# Altium project ESP32 with USBC.PrjPcb
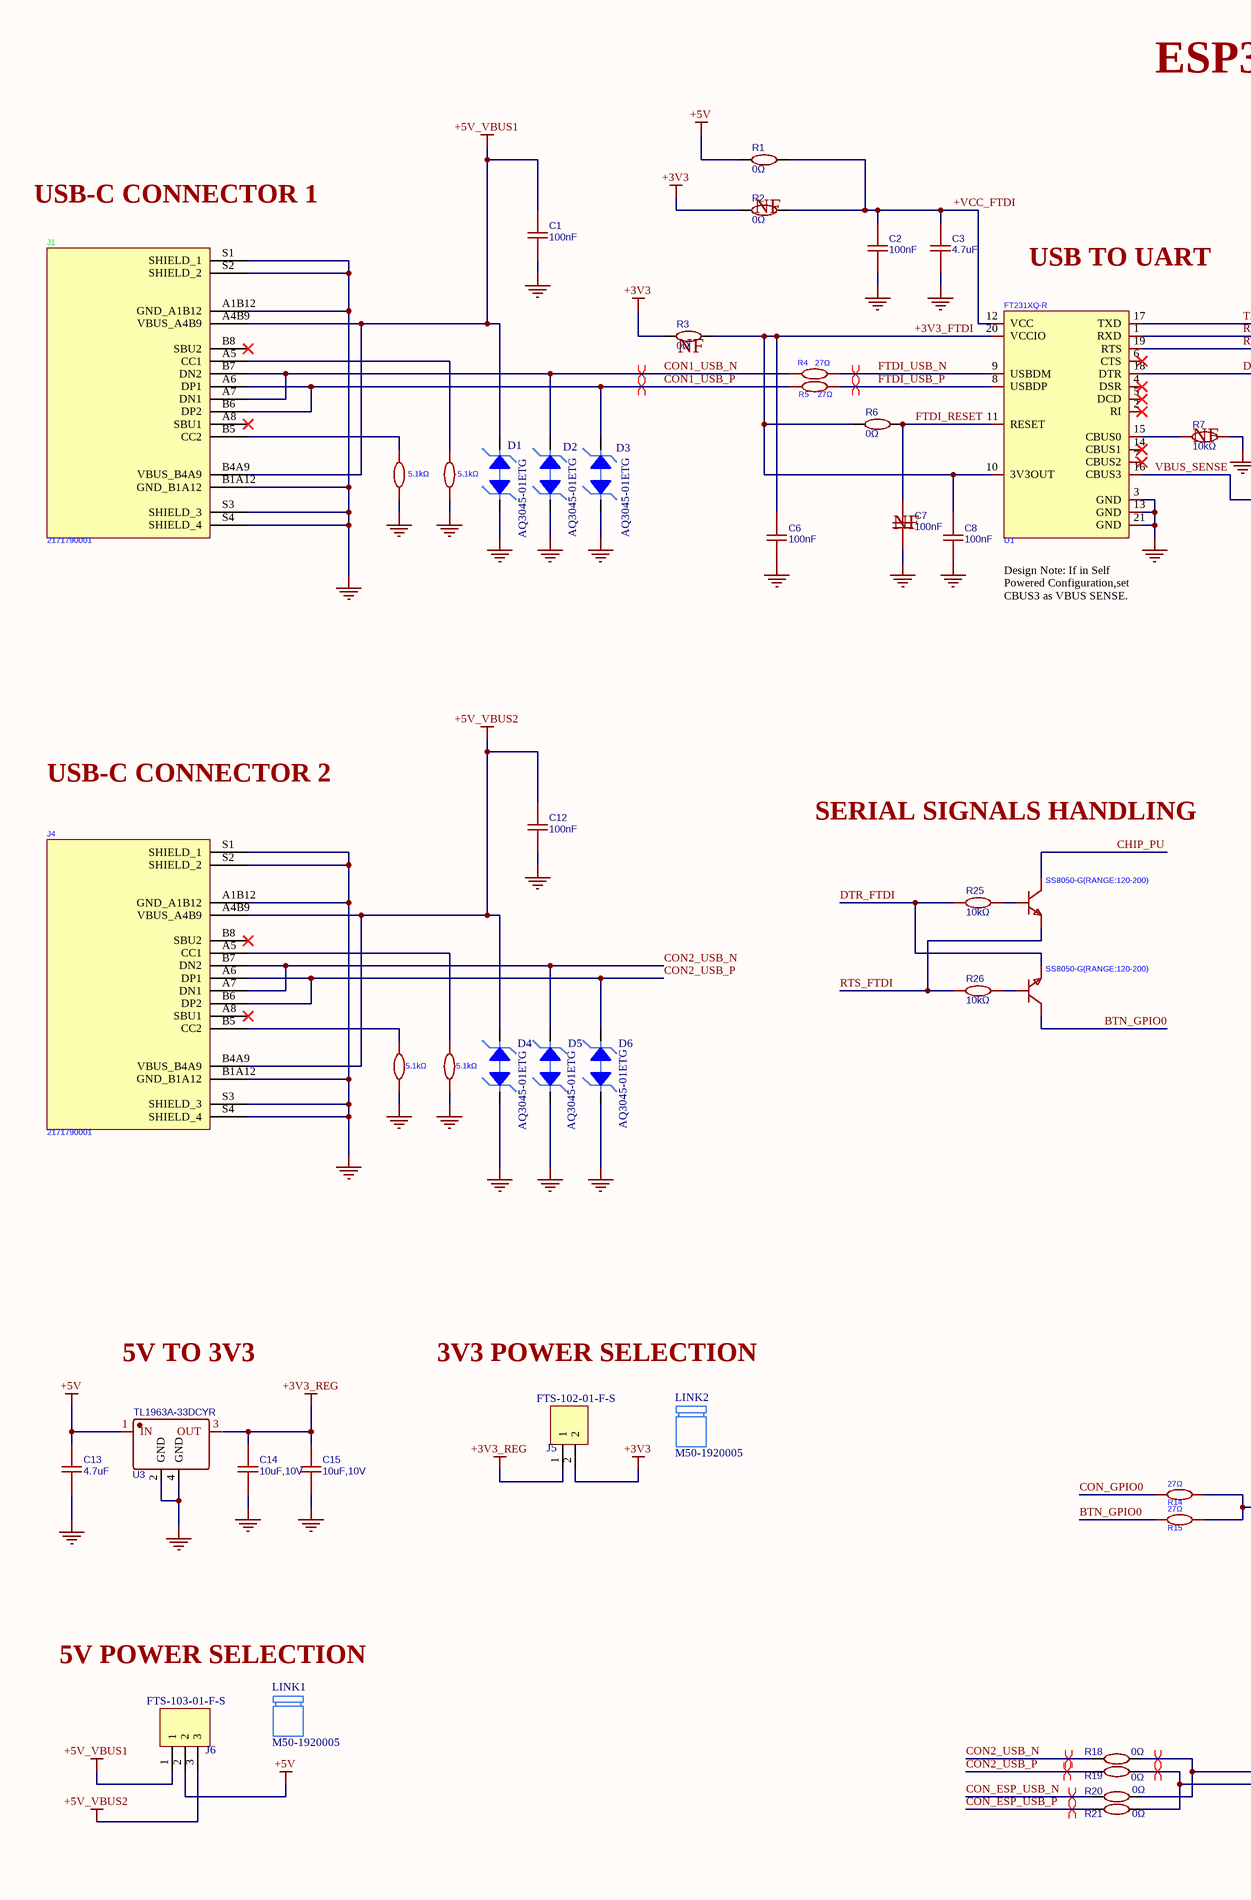
[diagram p0: ESP32 with USBC SCH.SchDoc, left]
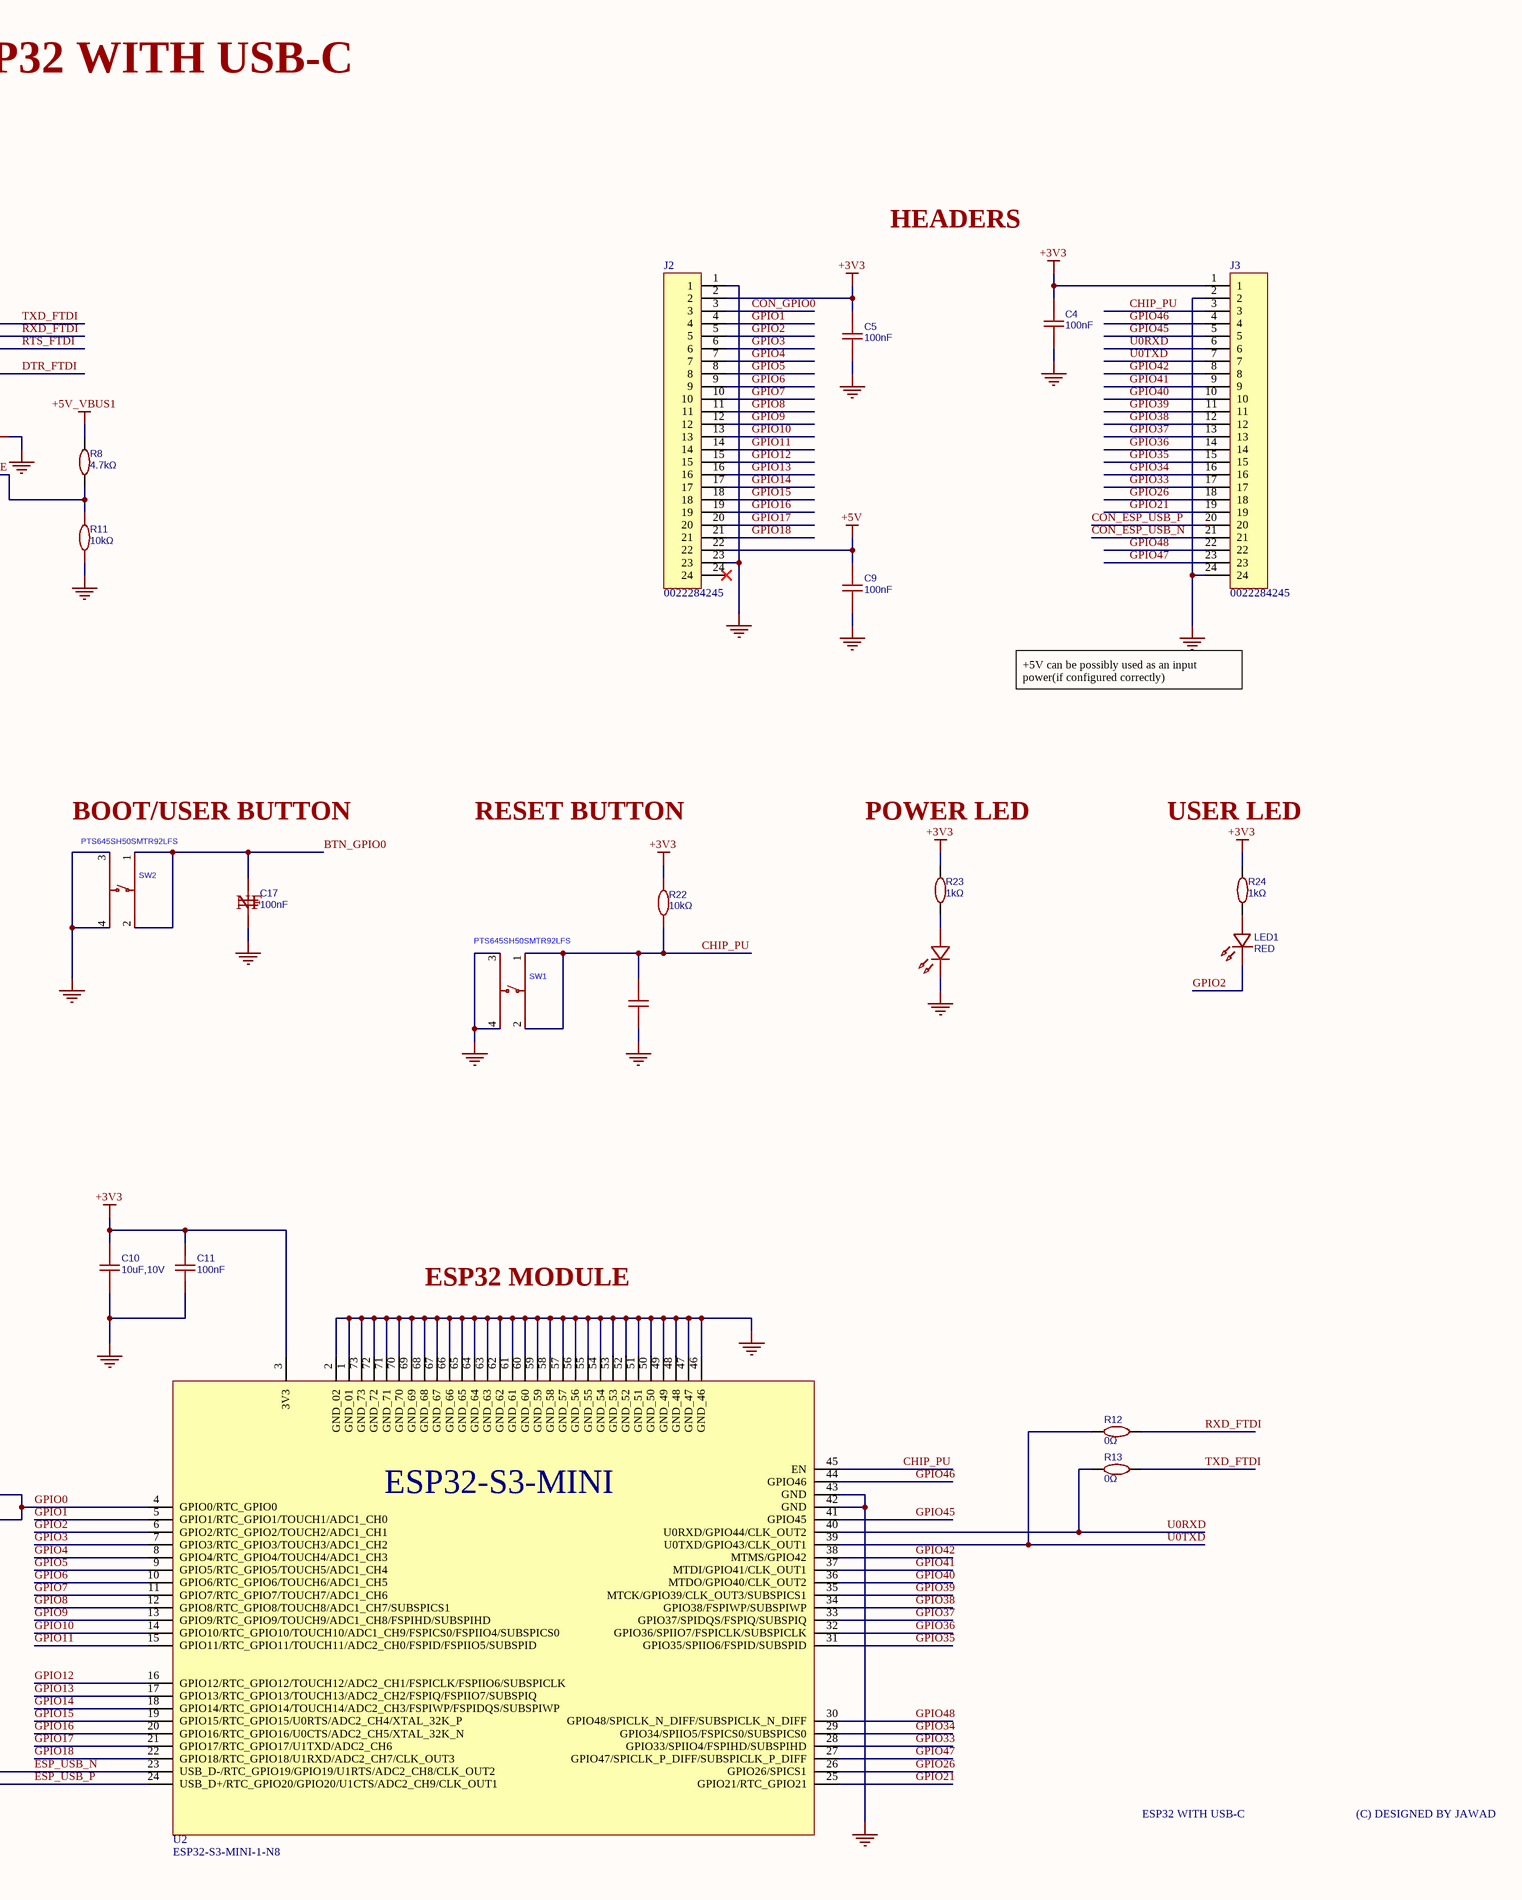
[diagram p1: ESP32 with USBC SCH.SchDoc, right]
1 sheet, 66 parts. Net scope: global (net labels, ports and power ports of the same name join across sheets).
Board file: ESP32 with USBC PCB.PcbDoc

## Sheet ESP32 with USBC SCH.SchDoc
size A2; SheetNumber: 1; SheetTotal: 1

### Parts
C1  100nF  [C0402]
C2  100nF  [C0402]
C3  4.7uF  [C0402]
C4  100nF  [C0402]
C5  100nF  [C0402]
C6  100nF  [C0402]
C7  100nF  [C0402]
C8  100nF  [C0402]
C9  100nF  [C0402]
C10  10uF,10V  [C0402]
C11  100nF  [C0402]
C12  100nF  [C0402]
C13  4.7uF  [C0402]
C14  10uF,10V  [C0402]
C15  10uF,10V  [C0402]
C16  1uF,35V  [C0402]  (value not drawn)
C17  100nF  [C0402]
D1  AQ3045-01ETG  [SOD882]
D2  AQ3045-01ETG  [SOD882]
D3  AQ3045-01ETG  [SOD882]
D4  AQ3045-01ETG  [SOD882]
D5  AQ3045-01ETG  [SOD882]
D6  AQ3045-01ETG  [SOD882]
J1  2171790001  [USB-C-SMD_2171790001]
J2  0022284245  [HDR_1X24_2.54MM]
J3  0022284245  [HDR_1X24_2.54MM]
J4  2171790001  [USB-C-SMD_2171790001]
J5  FTS-102-01-F-S  [HDR_1X2_1.27MM]
J6  FTS-103-01-F-S  [HDR_1X3_1.27MM]
LED1  RED  [LED0402-RD_RED]
LED2  VLMG1500-GS08  [LED0402-RD_GREEN]  (value not drawn)
LINK1  M50-1920005  (mechanical)
LINK2  M50-1920005  (mechanical)
Q1  SS8050-G(RANGE:120-200)  [SOT-23-3_L2.9-W1.3-P1.90-LS2.4-BR]
Q2  SS8050-G(RANGE:120-200)  [SOT-23-3_L2.9-W1.3-P1.90-LS2.4-BR]
R1  0Ω  [R0402]
R2  0Ω  [R0402]
R3  0Ω  [R0402]
R4  27Ω  [R0402]
R5  27Ω  [R0402]
R6  0Ω  [R0402]
R7  10kΩ  [R0402]
R8  4.7kΩ  [R0402]
R9  5.1kΩ  [R0402]
R10  5.1kΩ  [R0402]
R11  10kΩ  [R0402]
R12  0Ω  [R0402]
R13  0Ω  [R0402]
R14  27Ω  [R0402]
R15  27Ω  [R0402]
R16  5.1kΩ  [R0402]
R17  5.1kΩ  [R0402]
R18  0Ω  [R0402]
R19  0Ω  [R0402]
R20  0Ω  [R0402]
R21  0Ω  [R0402]
R22  10kΩ  [R0402]
R23  1kΩ  [R0402]
R24  1kΩ  [R0402]
R25  10kΩ  [R0402]
R26  10kΩ  [R0402]
SW1  PTS645SH50SMTR92LFS  [KEY-SMD_4P-L6.0-W6.0-P4.50-LS9.0]
SW2  PTS645SH50SMTR92LFS  [KEY-SMD_4P-L6.0-W6.0-P4.50-LS9.0]
U1  FT231XQ-R  [QFN-20_L4.0-W4.0-P0.50-BL-EP2.2]
U2  ESP32-S3-MINI-1-N8  [XCVR_ESP32-S3-MINI-1-N8]
U3  TL1963A-33DCYR  [SOT-223_L6.5-W3.5-P2.30-LS7.0-BR]

### Nets
+3V3: C4.2 C5.2 C10.2 C11.2 J2.2 J3.1 J5.2 R2.1 R3.1 R22.2 R23.2 R24.2 U2.3(3V3)
+3V3_REG: C14.2 C15.2 J5.1
+5V: C9.2 C13.2 J2.22 J6.2 R1.1 U3.1(IN)
+5V_VBUS1: C1.2 D1.1 J1.A4B9(VBUS_A4B9) J1.B4A9(VBUS_B4A9) J6.1 R8.2
+5V_VBUS2: C12.2 D4.1 J4.A4B9(VBUS_A4B9) J4.B4A9(VBUS_B4A9) J6.3
GND: C1.1 C2.1 C3.1 C4.1 C5.1 C6.1 C7.1 C8.1 C9.1 C10.1 C11.1 C12.1 C13.1 C14.1 C15.1 C16.1 C17.1 D1.2 D2.2 D3.2 D4.2 D5.2 D6.2 J1.A1B12(GND_A1B12) J1.B1A12(GND_B1A12) J1.S1(SHIELD_1) J1.S2(SHIELD_2) J1.S3(SHIELD_3) J1.S4(SHIELD_4) J2.1 J2.23 J3.2 J3.24 J4.A1B12(GND_A1B12) J4.B1A12(GND_B1A12) J4.S1(SHIELD_1) J4.S2(SHIELD_2) J4.S3(SHIELD_3) J4.S4(SHIELD_4) LED2.1(K) R7.1 R9.1 R10.1 R11.1 R16.1 R17.1 SW1.3 SW1.4 SW2.3 SW2.4 U1.3(GND) U1.13(GND) U1.21(GND) U2.1(GND_01) U2.2(GND_02) U2.42(GND) U2.43(GND) U2.46(GND_46) U2.47(GND_47) U2.48(GND_48) U2.49(GND_49) U2.50(GND_50) U2.51(GND_51) U2.52(GND_52) U2.53(GND_53) U2.54(GND_54) U2.55(GND_55) U2.56(GND_56) U2.57(GND_57) U2.58(GND_58) U2.59(GND_59) U2.60(GND_60) U2.61(GND_61) U2.62(GND_62) U2.63(GND_63) U2.64(GND_64) U2.65(GND_65) U2.66(GND_66) U2.67(GND_67) U2.68(GND_68) U2.69(GND_69) U2.70(GND_70) U2.71(GND_71) U2.72(GND_72) U2.73(GND_73) U3.2(GND) U3.4(GND)
+3V3_FTDI: C6.2 C8.2 R3.2 R6.1 U1.10(3V3OUT) U1.20(VCCIO)
+VCC_FTDI: C2.2 C3.2 R1.2 R2.2 U1.12(VCC)
BTN_GPIO0: C17.2 Q2.3(C) R15.1 SW2.1 SW2.2
CHIP_PU: C16.2 J3.3 Q1.3(C) R22.1 SW1.1 SW1.2 U2.45(EN)
CON1_USB_N: D2.1 J1.A7(DN1) J1.B7(DN2) R4.1
CON1_USB_P: D3.1 J1.A6(DP1) J1.B6(DP2) R5.1
CON2_USB_N: D5.1 J4.A7(DN1) J4.B7(DN2) R18.1
CON2_USB_P: D6.1 J4.A6(DP1) J4.B6(DP2) R19.1
CON_ESP_USB_N: J3.21 R20.1
CON_ESP_USB_P: J3.20 R21.1
CON_GPIO0: J2.3 R14.1
DTR_FTDI: Q2.2(E) R25.2 U1.18(DTR)
ESP_USB_N: R18.2 R20.2 U2.23(USB_D-/RTC_GPIO19/GPIO19/U1RTS/ADC2_CH8/CLK_OUT2)
ESP_USB_P: R19.2 R21.2 U2.24(USB_D+/RTC_GPIO20/GPIO20/U1CTS/ADC2_CH9/CLK_OUT1)
FTDI_RESET: C7.2 R6.2 U1.11(RESET)
FTDI_USB_N: R4.2 U1.9(USBDM)
FTDI_USB_P: R5.2 U1.8(USBDP)
GPIO0: R14.2 R15.2 U2.4(GPIO0/RTC_GPIO0)
GPIO1: J2.4 U2.5(GPIO1/RTC_GPIO1/TOUCH1/ADC1_CH0)
GPIO2: J2.5 LED1.1(-) U2.6(GPIO2/RTC_GPIO2/TOUCH2/ADC1_CH1)
GPIO3: J2.6 U2.7(GPIO3/RTC_GPIO3/TOUCH3/ADC1_CH2)
GPIO4: J2.7 U2.8(GPIO4/RTC_GPIO4/TOUCH4/ADC1_CH3)
GPIO5: J2.8 U2.9(GPIO5/RTC_GPIO5/TOUCH5/ADC1_CH4)
GPIO6: J2.9 U2.10(GPIO6/RTC_GPIO6/TOUCH6/ADC1_CH5)
GPIO7: J2.10 U2.11(GPIO7/RTC_GPIO7/TOUCH7/ADC1_CH6)
GPIO8: J2.11 U2.12(GPIO8/RTC_GPIO8/TOUCH8/ADC1_CH7/SUBSPICS1)
GPIO9: J2.12 U2.13(GPIO9/RTC_GPIO9/TOUCH9/ADC1_CH8/FSPIHD/SUBSPIHD)
GPIO10: J2.13 U2.14(GPIO10/RTC_GPIO10/TOUCH10/ADC1_CH9/FSPICS0/FSPIIO4/SUBSPICS0)
GPIO11: J2.14 U2.15(GPIO11/RTC_GPIO11/TOUCH11/ADC2_CH0/FSPID/FSPIIO5/SUBSPID)
GPIO12: J2.15 U2.16(GPIO12/RTC_GPIO12/TOUCH12/ADC2_CH1/FSPICLK/FSPIIO6/SUBSPICLK)
GPIO13: J2.16 U2.17(GPIO13/RTC_GPIO13/TOUCH13/ADC2_CH2/FSPIQ/FSPIIO7/SUBSPIQ)
GPIO14: J2.17 U2.18(GPIO14/RTC_GPIO14/TOUCH14/ADC2_CH3/FSPIWP/FSPIDQS/SUBSPIWP)
GPIO15: J2.18 U2.19(GPIO15/RTC_GPIO15/U0RTS/ADC2_CH4/XTAL_32K_P)
GPIO16: J2.19 U2.20(GPIO16/RTC_GPIO16/U0CTS/ADC2_CH5/XTAL_32K_N)
GPIO17: J2.20 U2.21(GPIO17/RTC_GPIO17/U1TXD/ADC2_CH6)
GPIO18: J2.21 U2.22(GPIO18/RTC_GPIO18/U1RXD/ADC2_CH7/CLK_OUT3)
GPIO21: J3.19 U2.25(GPIO21/RTC_GPIO21)
GPIO26: J3.18 U2.26(GPIO26/SPICS1)
GPIO33: J3.17 U2.28(GPIO33/SPIIO4/FSPIHD/SUBSPIHD)
GPIO34: J3.16 U2.29(GPIO34/SPIIO5/FSPICS0/SUBSPICS0)
GPIO35: J3.15 U2.31(GPIO35/SPIIO6/FSPID/SUBSPID)
GPIO36: J3.14 U2.32(GPIO36/SPIIO7/FSPICLK/SUBSPICLK)
GPIO37: J3.13 U2.33(GPIO37/SPIDQS/FSPIQ/SUBSPIQ)
GPIO38: J3.12 U2.34(GPIO38/FSPIWP/SUBSPIWP)
GPIO39: J3.11 U2.35(MTCK/GPIO39/CLK_OUT3/SUBSPICS1)
GPIO40: J3.10 U2.36(MTDO/GPIO40/CLK_OUT2)
GPIO41: J3.9 U2.37(MTDI/GPIO41/CLK_OUT1)
GPIO42: J3.8 U2.38(MTMS/GPIO42)
GPIO45: J3.5 U2.41(GPIO45)
GPIO46: J3.4 U2.44(GPIO46)
GPIO47: J3.23 U2.27(GPIO47/SPICLK_P_DIFF/SUBSPICLK_P_DIFF)
GPIO48: J3.22 U2.30(GPIO48/SPICLK_N_DIFF/SUBSPICLK_N_DIFF)
RTS_FTDI: Q1.2(E) R26.2 U1.19(RTS)
RXD_FTDI: R12.2 U1.1(RXD)
TXD_FTDI: R13.2 U1.17(TXD)
U0RXD: J3.6 R13.1 U2.40(U0RXD/GPIO44/CLK_OUT2)
U0TXD: J3.7 R12.1 U2.39(U0TXD/GPIO43/CLK_OUT1)
VBUS_SENSE: R8.1 R11.2 U1.16(CBUS3)
NetJ1_A5: J1.A5(CC1) R10.2
NetJ1_B5: J1.B5(CC2) R9.2
NetJ4_A5: J4.A5(CC1) R17.2
NetJ4_B5: J4.B5(CC2) R16.2
NetLED1_2: LED1.2(+) R24.1
NetLED2_2: LED2.2(A) R23.1
NetQ1_1: Q1.1(B) R25.1
NetQ2_1: Q2.1(B) R26.1
NetR7_2: R7.2 U1.15(CBUS0)

Not connected (* = marked no-connect by the designer): J1 A8(SBU1)* B8(SBU2)*; J2 24*; J4 A8(SBU1)* B8(SBU2)*; U1 2(RI)* 4(DSR)* 5(DCD)* 6(CTS)* 7(CBUS2)* 14(CBUS1)*; U3 3(OUT)

### Layout directives
differential pair; differential pair class DIFF90: CON1_USB_N, CON1_USB_P, CON2_USB_N, CON2_USB_P, CON_ESP_USB_N, CON_ESP_USB_P, ESP_USB_N, ESP_USB_P, FTDI_USB_N, FTDI_USB_P

### Notes on the sheet
- ESP32 WITH USB-C
- USB-C CONNECTOR 1
- (near R2) NF
- HEADERS
- USB TO UART
- (near R3) NF
- (near R7) NF
- (near C7) NF
- Design Note: If in Self Powered Configuration,set CBUS3 as VBUS SENSE.
- +5V can be possibly used as an input power(if configured correctly)
- USB-C CONNECTOR 2
- SERIAL SIGNALS HANDLING
- (near SW2) BOOT/USER BUTTON
- RESET BUTTON
- POWER LED
- USER LED
- (near C17) NF
- ESP32 MODULE
- 5V TO 3V3
- (near LINK2) 3V3 POWER SELECTION
- (near LINK1) 5V POWER SELECTION
- (C) DESIGNED BY JAWAD
- (in symbol ESP32-S3-MINI-1-N8) ESP32-S3-MINI

### Library data of the parts
C1 C2 C4-C9 C11 C12 C17 = 100nF,50V: CAP CER 0.1UF 50V X7R 0402; Manufacturer: SAMSUNG(三星); Manufacturer Part: CL05B104KB5NNNC; nameAlias: Value; Contributor: LCSC; Supplier: LCSC; Supplier Part: C960916; JLCPCB Part Class: Extended Part; spicePre: C; spiceSymbolName: CL05B104KB5NNNC; LCSC Part Number: C960916
C3 C13 = 4.7uF: CAP CER 4.7UF 16V X5R 0402; Manufacturer: SAMSUNG(三星); Manufacturer Part: CL05A475MO5NUNC; nameAlias: Value; Contributor: LCSC; Supplier: LCSC; Supplier Part: C318563; JLCPCB Part Class: Extended Part; spicePre: C; spiceSymbolName: CL05A475MO5NUNC; LCSC Part Number: C318563
C10 C14 C15 = 10uF: CAP CER 10UF 10V X5R 0402; Manufacturer: muRata(村田); Manufacturer Part: GRM155R61A106ME11D; nameAlias: Value; Contributor: LCSC; Supplier: LCSC; Supplier Part: C408132; JLCPCB Part Class: Extended Part; spicePre: C; spiceSymbolName: GRM155R61A106ME11D; LCSC Part Number: C408132
C16 = CL05A105KL5NRNC: CAP CER 1UF 35V X5R 0402; Manufacturer: SAMSUNG(三星); Add into BOM: yes; Tolerance: ±10%; Symbol: CL05A105KL5NRNC; Device: CL05A105KL5NRNC; LCSC Part Name: 1uF ±10% 35V; Supplier Part: C307413; Manufacturer Part: CL05A105KL5NRNC; Supplier Footprint: 0402; JLCPCB Part Class: Extended Part; Datasheet: https://atta.szlcsc.com/upload/public/pdf/source/20160218/1457707763339.pdf; Supplier: LCSC; Convert to PCB: yes; Value: 1uF; LCSC Part Number: C307413
D1-D6 = AQ3045-01ETG: TVS DIODE 5.3VWM 12VC SOD882; LCSC Part Number: C3710326
J1 J4 = 2171790001: CONN RCP USB2.0 TYP C 24P SMD RA; Manufacturer: MOLEX; Add into BOM: yes; Symbol: 2171790001; Device: 2171790001; LCSC Part Name: 2171790001; Supplier Part: C3197684; Manufacturer Part: 2171790001; Supplier Footprint: SMD; JLCPCB Part Class: Extended Part; Datasheet: https://www.molex.com/content/dam/molex/molex-dot-com/products/automated/en-us/salesdrawingpdf/217/217179/2171790001_sd.pdf?inline\; Supplier: LCSC; Convert to PCB: yes; LCSC Part Number: C3197684
J2 J3 = 0022284245: CONN HEADER VERT 24POS 2.54MM; Parameter 1: *
J5 = FTS-102-01-F-S: CONN HEADER VERT 24POS 2.54MM; LCSC Part Number: C6045317
J6 = FTS-103-01-F-S: CONN HEADER VERT 3POS 1.27MM; LCSC Part Number: C3333578
LED1 = VLMS1500-GS08: LED RED 0402 SMD; Manufacturer: VISHAY(威世); Contributor: LCSC; Supplier: LCSC; Supplier Part: C511370; Manufacturer Part: VLMS1500-GS08; JLCPCB Part Class: Extended Part; spicePre: L; spiceSymbolName: VLMS1500-GS08
LED2 = VLMG1500-GS08: LED YLW-GRN 0402 SMD; Manufacturer: VISHAY(威世); Add into BOM: yes; Emitted Color: Green-yellow; Forward Voltage (VF): 2V; Forward Current: 20mA; Dominant Wavelength: 571nm; Peak Wavelength: 574nm; Luminous Intensity: 35mcd; Viewing Angle: 130°; Symbol: VLMG1500-GS08; Device: VLMG1500-GS08; LCSC Part Name: 普绿/黄绿; Supplier Part: C511404; Manufacturer Part: VLMG1500-GS08; Supplier Footprint: 0402; JLCPCB Part Class: Extended Part; Datasheet: https://atta.szlcsc.com/upload/public/pdf/source/20200408/C511042_90D3007A8FB4E63E401D7A77D5F44EFD.pdf; Supplier: LCSC; Convert to PCB: yes
LINK1 LINK2 = M50-1920005: CONN SHUNT 1.27MM RED; LCSC Part Number: C6985646
Q1 Q2 = SS8050-G(RANGE:120-200): TRANS NPN 25V 1.5A SOT-23-3; Manufacturer: CJ(江苏长电/长晶); Add into BOM: yes; Pd - Power Dissipation: 300mW; DC Current Gain: 120@100mA,1V; Transition frequency(fT): 100MHz; Current - Collector Cutoff: 100nA; Vce Saturation(VCE(sat)): 500mV; Symbol: SS8050-G; Device: SS8050-G(RANGE:120-200); LCSC Part Name: L档(120-200); Supplier Part: C164886; Manufacturer Part: SS8050-G(RANGE:120-200); Supplier Footprint: SOT-23; JLCPCB Part Class: Extended Part; Datasheet: https://atta.szlcsc.com/upload/public/pdf/source/20180130/C177739_15172974524031323483.pdf; Supplier: LCSC; Convert to PCB: yes; type: NPN; Operating Temperature: -55℃~+150℃; LCSC Part Number: C164886
R1-R3 R6 R12 R13 R18-R21 = 0Ω: RES 0 OHM JUMPER 1/16W 0402; Manufacturer: YAGEO(国巨); Manufacturer Part: RC0402FR-070RL; nameAlias: Value; Supplier: LCSC; Supplier Part: C106231; JLCPCB Part Class: Extended Part; spicePre: R; spiceSymbolName: RC0402FR-070RL; LCSC part Number: C106231
R4 R5 R14 R15 = RC0402FR-0727RL: RES 27 OHM 1% 1/16W 0402; Manufacturer: YAGEO(国巨); Add into BOM: yes; Temperature Coefficient: ±100ppm/℃; Symbol: RC0402FR-0727RL; Device: RC0402FR-0727RL; LCSC Part Name: 厚膜电阻 27Ω ±1% 62.5mW; Supplier Part: C138021; Manufacturer Part: RC0402FR-0727RL; Supplier Footprint: 0402; JLCPCB Part Class: Extended Part; Datasheet: https://atta.szlcsc.com/upload/public/pdf/source/20181009/C309620_DA5935B6E1D48212CB7A533FE518B3C2.pdf; Supplier: LCSC; Convert to PCB: yes; Type: Thick Film Resistors; Value: 27Ω; Tolerance: ±1%; Operating Temperature Range: -55℃~+155℃; LCSC Part Number: C138021
R7 R11 R22 R25 R26 = 10kΩ: RES SMD 10K OHM 1% 1/16W 0402; Manufacturer: YAGEO(国巨); Manufacturer Part: AC0402FR-0710KL; nameAlias: Value; Contributor: LCSC; Supplier: LCSC; Supplier Part: C144807; JLCPCB Part Class: Extended Part; spicePre: R; spiceSymbolName: AC0402FR-0710KL; LCSC Part Number: C144807
R8 = 4.7kΩ: RES 4.7K OHM 1% 1/16W 0402; Manufacturer: YAGEO(国巨); Manufacturer Part: RC0402FR-074K7L; nameAlias: Value; Supplier: LCSC; Supplier Part: C105871; JLCPCB Part Class: Extended Part; spicePre: R; spiceSymbolName: RC0402FR-074K7L; LCSC Part Number: C105871
R9 R10 R16 R17 = AC0402FR-075K1L: RES SMD 5.1K OHM 1% 1/16W 0402; Manufacturer: YAGEO(国巨); Add into BOM: yes; Temperature Coefficient: ±100ppm/℃; Symbol: AC0402FR-075K1L; Device: AC0402FR-075K1L; LCSC Part Name: 厚膜电阻 5.1kΩ ±1% 62.5mW; Supplier Part: C144745; Manufacturer Part: AC0402FR-075K1L; Supplier Footprint: 0402; JLCPCB Part Class: Extended Part; Datasheet: https://atta.szlcsc.com/upload/public/pdf/source/20180927/C229861_4ABDC471507C1ED6AFB4BA66AFC8620A.pdf; Supplier: LCSC; Convert to PCB: yes; Type: Thick Film Resistors; Value: 5.1kΩ; Tolerance: ±1%; Operating Temperature Range: -55℃~+155℃; LCSC Part Number: C144745
R23 R24 = 1kΩ: RES 1K OHM 1% 1/16W 0402; Manufacturer: YAGEO(国巨); Manufacturer Part: RC0402FR-071KL; nameAlias: Value; Supplier: LCSC; Supplier Part: C106235; JLCPCB Part Class: Extended Part; spicePre: R; spiceSymbolName: RC0402FR-071KL; LCSC Part Number: C106235
SW1 SW2 = PTS645SH50SMTR92LFS: Tactile Switch SPST-NO Top Actuated Surface Mount; Manufacturer: C&K; Add into BOM: yes; Circuit: SPST; Actuator Style: Round Button; Operating Force: 200gf; Switch Length: 6mm; Switch Height: 5mm; Contact Current: 50mA; Voltage Rating (DC): 12V; Pin Style: Gullwing; Symbol: PTS645SH50SMTR92LFS; Device: PTS645SH50SMTR92LFS; LCSC Part Name: 6*6*5mm 立贴 轻触开关; Supplier Part: C221869; Manufacturer Part: PTS645SH50SMTR92LFS; Supplier Footprint: SMD,6x6mm; JLCPCB Part Class: Extended Part; Datasheet: https://atta.szlcsc.com/upload/public/pdf/source/20190108/C285530_E89B379DE8DD14E424006A6061D0203A.pdf; Supplier: LCSC; Convert to PCB: yes; Mounting Style: Standing paste; Switch Width: 6mm; With Lamp: -; Mechanical Life: -; Operating Temperature: -40℃~+85℃; LCSC Part Number: C221869
U1 = FT231XQ-R: IC USB SERIAL FULL UART 20QFN; Manufacturer: FTDI(飞特帝亚); Add into BOM: yes; Applications Function: USB to UART; Voltage - Supply: 3.3V~5V; Symbol: FT231XQ-R; Device: FT231XQ-R; LCSC Part Name: FT231X USB至全握手UART IC; Supplier Part: C132159; Manufacturer Part: FT231XQ-R; Supplier Footprint: QFN-20-EP(4x4); JLCPCB Part Class: Extended Part; Datasheet: https://atta.szlcsc.com/upload/public/pdf/source/20171113/C132160_15105610735521115430.pdf; Supplier: LCSC; Convert to PCB: yes; Protocol: -; Operating Temperature: -40℃~+85℃; LCSC Part Number: C132159
U3 = TL1963A-33DCYR: IC REG LIN 3.3V 1.5A SOT-223-4; Manufacturer: TI(德州仪器); Contributor: LCSC; Supplier: LCSC; Manufacturer Part: TL1963A-33DCYR; Supplier Part: C181262; JLCPCB Part Class: Extended Part; spicePre: U; spiceSymbolName: TL1963A-33DCYR; LCSC Part Number: C181262
U2 = ESP32-S3-MINI-1-N8: LCSC Part Number: C2913206